# Altium project ECU V1.0 B.PrjPcb (part 16 of 17)
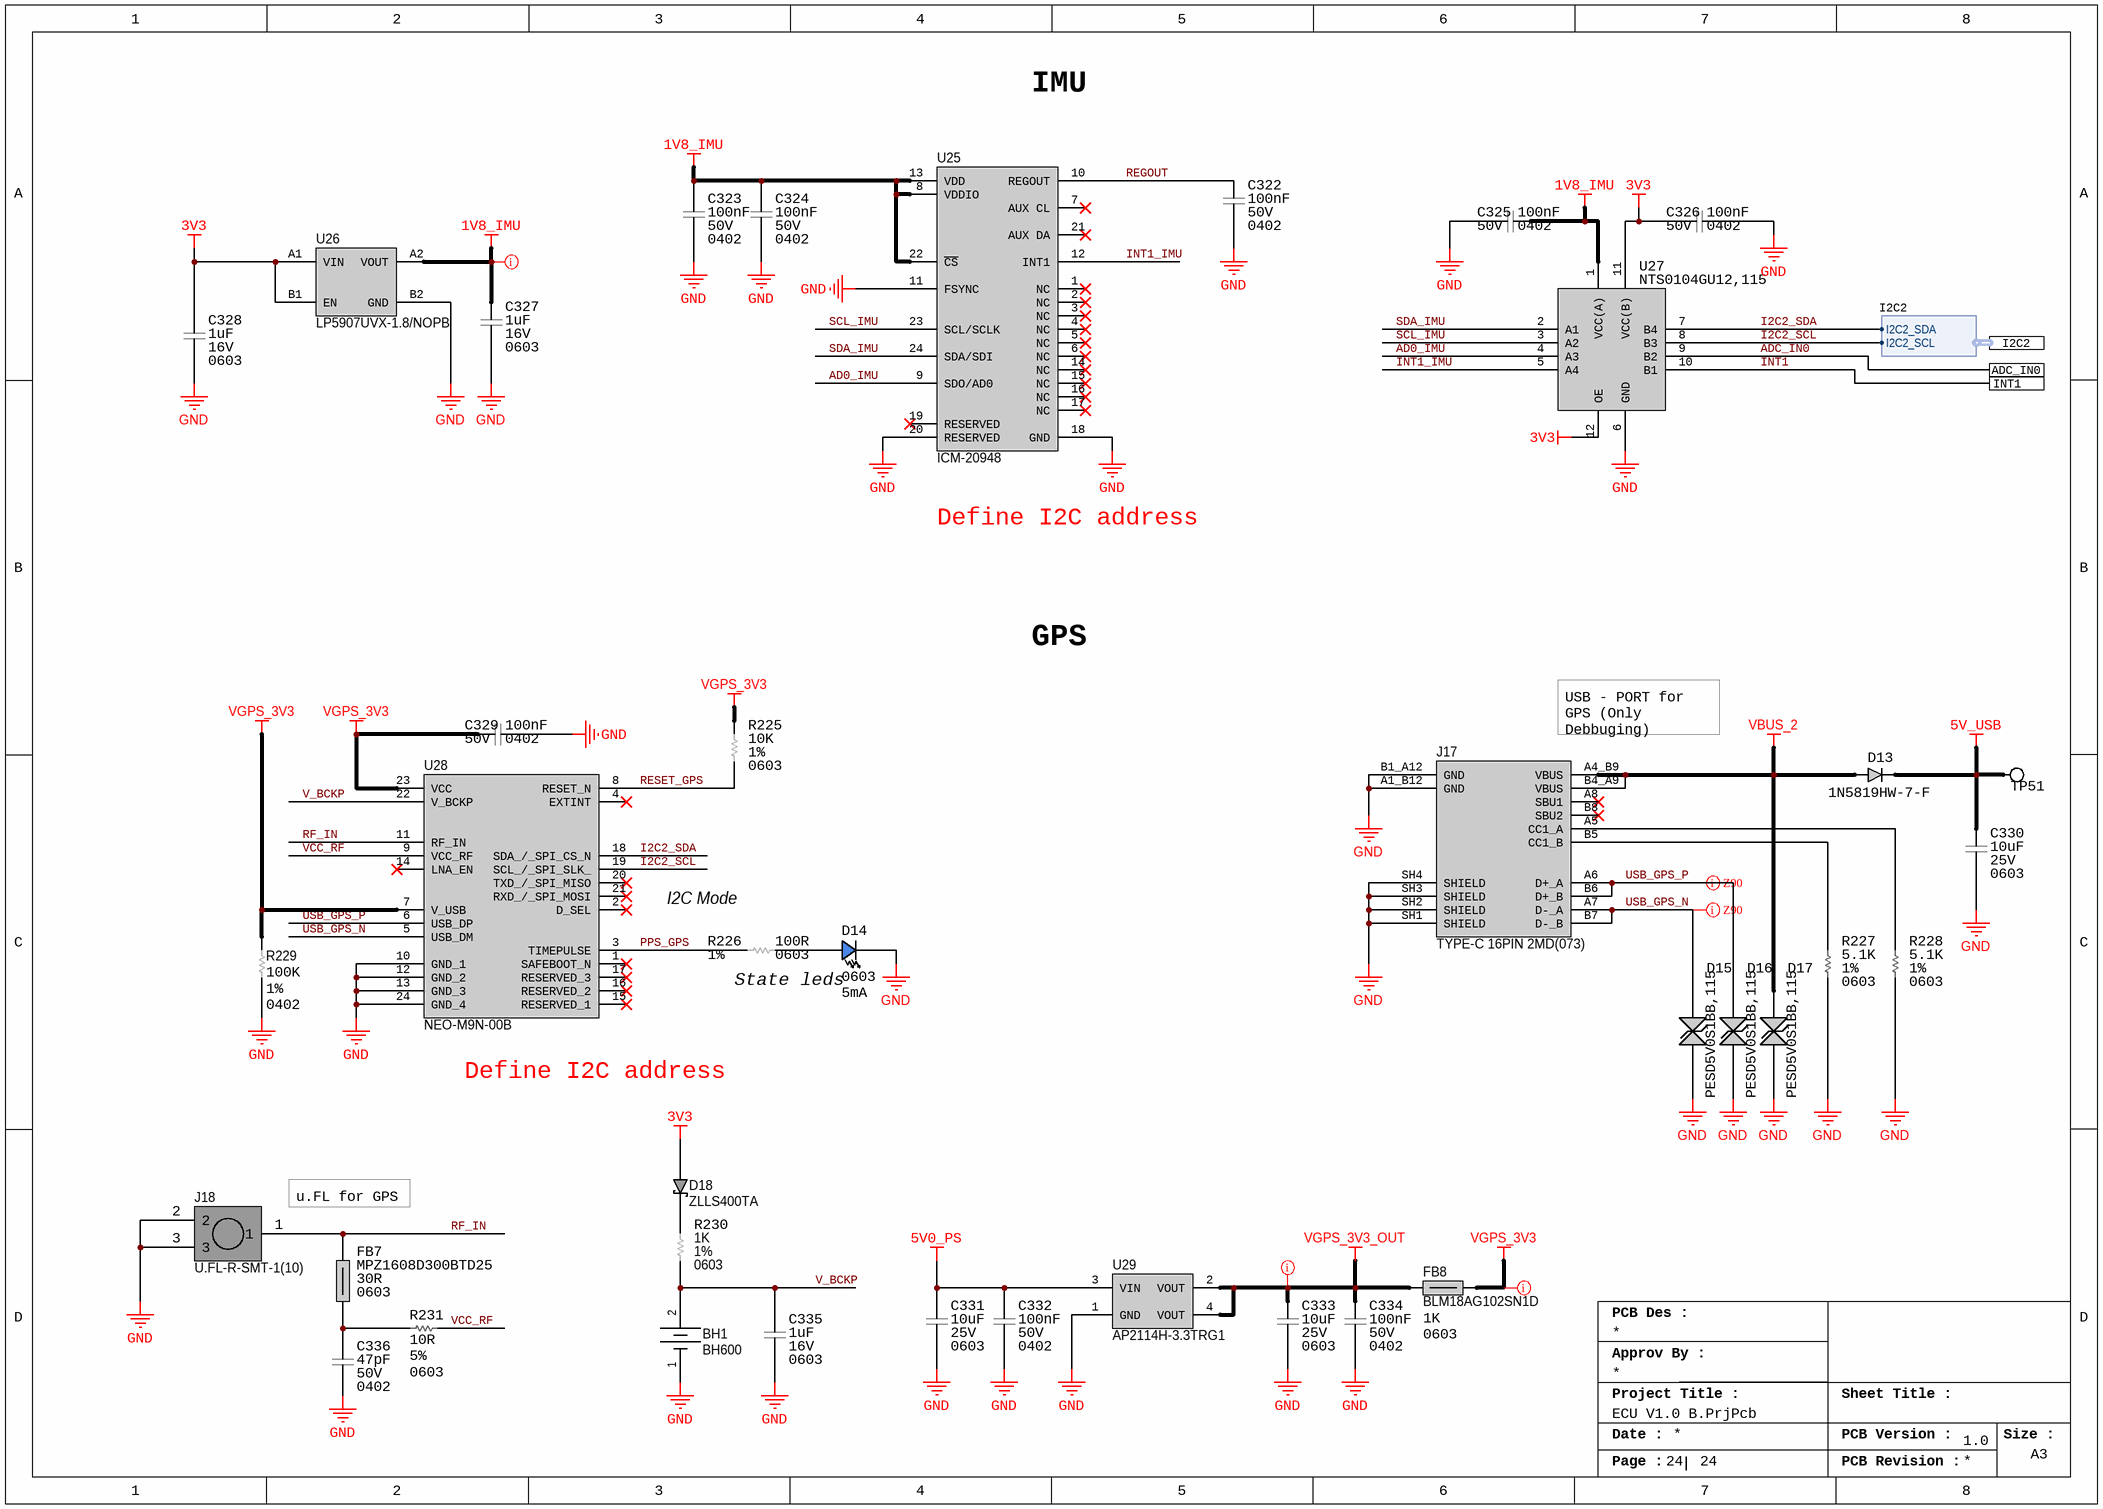
[diagram p22: 23_IMU_GPS.SchDoc]

## Sheet 23_IMU_GPS.SchDoc (continued)

### Library data of the parts
BH1 = MECH_BATTERY_HOLDER_BH600: Battery Holder 1 Cells Thermoplastic Tray; Manufacturer: Memory Protection Devices; Number of Cells: 1; Supplier 1: Digikey; Manufacturer Part Number: BH600; RoHS: Yes; Category: Batteries and Accessories; Stock 1: 122929; Pricing 1: 1=1.7, 10=1.408, 50=1.236, 100=1.1686, 300=1.06927, 500=1.02602, 1000=0.97012, 2500=0.90087, 5000=0.85178 (USD); Mount: Through Hole,PCB; Min Operating Temperature: -55°C; Max Operating Temperature: 180°C; Series: -; Termination: PC Pin; Diameter: 16mm; Height: 3.2mm; Lead Free: Lead Free; RoHS Compliant: Yes; ComponentLink1URL: https://datasheet.ciiva.com/3/bh600-datasheet-3856.pdf?src-supplier=Digikey; ComponentLink1Description: https://datasheet.ciiva.com/3/bh600-datasheet-3856.pdf?src-supplier=Digikey; Supplier Part Number 1: BH600-ND
C322-C326 C329 C332 C334 = CAP_100NF_50V_X7R_0402: Multilayer Ceramic Capacitor, 0.1 uF, 16 V, ± 10%, X7R, 0402 [1005 Metric]; Manufacturer: Murata; Dissipation Factor: 0.025%; Temperature Coefficient: 30ppm/°C; Supplier 1: DigiKey; Manufacturer Part Number: GRM155R71H104KE14D; RoHS: Yes; Category: Ceramic Capacitors; Stock 1: 13730790; Pricing 1: 1=0.1, 10=0.023, 50=0.0132, 100=0.0102, 500=0.00768, 1000=0.00603, 2500=0.00548, 5000=0.00504 (USD); Mount: Surface Mount; Number of Pins: 2NUMBER; Case Code (Metric): 1005; Material: Ceramic; Case Code (Imperial): 0402; Weight: 0.000212oz; Dielectric Material: Ceramic; Min Operating Temperature: -55°C; Max Operating Temperature: 125°C; Packaging: Tape and Reel; Package Quantity: 10000; Series: GRM; Tolerance: 10%; Dielectric: X7R; Termination: SMD/SMT; Voltage: 50V; Voltage Rating (DC): 50V; Construction: Flat; Length: 1mm; Width: 0.5mm; Height: 0.5mm; Depth: 0.5mm; Thickness: 0.022inch; Reach SVHC Compliant: No; RoHS Compliant: Yes; Lead Free: 5697LeadFree; ComponentLink1URL: http://www.farnell.com/datasheets/2079156.pdf?src-supplier=Farnell; ComponentLink1Description: http://www.farnell.com/datasheets/2079156.pdf?src-supplier=Farnell; ComponentLink2URL: http://www.mouser.com/ds/2/281/c02e-2905.pdf?src-supplier=Mouser; ComponentLink2Description: http://www.mouser.com/ds/2/281/c02e-2905.pdf?src-supplier=Mouser; ComponentLink3URL: http://www.farnell.com/datasheets/2079156.pdf?src-supplier=Newark; ComponentLink3Description: http://www.farnell.com/datasheets/2079156.pdf?src-supplier=Newark; ComponentLink4URL: https://datasheet.octopart.com/GRM155R71H104KE14D-Murata-datasheet-22122223.pdf?src-supplier=Future+Electronics; ComponentLink4Description: https://datasheet.octopart.com/GRM155R71H104KE14D-Murata-datasheet-22122223.pdf?src-supplier=Future+Electronics; ComponentLink5URL: https://search.murata.co.jp/Ceramy/image/img/A01X/G101/ENG/GRM155R71H104KE14-01.pdf?src-supplier=Digi-Key; ComponentLink5Description: https://search.murata.co.jp/Ceramy/image/img/A01X/G101/ENG/GRM155R71H104KE14-01.pdf?src-supplier=Digi-Key; ComponentLink6URL: http://psearch.en.murata.com/capacitor/product/GRM155R71H104KE14%23.pdf?src-supplier=Avnet; ComponentLink6Description: http://psearch.en.murata.com/capacitor/product/GRM155R71H104KE14%23.pdf?src-supplier=Avnet; ComponentLink7URL: https://datasheet.octopart.com/GRM155R71H104KE14D-Murata-datasheet-66077078.pdf?src-supplier=Element14; ComponentLink7Description: https://datasheet.octopart.com/GRM155R71H104KE14D-Murata-datasheet-66077078.pdf?src-supplier=Element14; Supplier Part Number 1: 490-10700-6-ND; Supplier 2: Digikey; Stock 2: 3706055; Pricing 2: 1=0.1, 10=0.037, 50=0.021, 100=0.0162, 500=0.01224, 1000=0.00961, 2500=0.00874, 5000=0.00804 (USD); Halogen Free: 5694HalogenFree; ComponentLink8URL: http://www.mouser.com/ds/2/447/UPY-GPHC_X5R_4V-to-50V_25-1131599.pdf?src-supplier=Mouser; ComponentLink8Description: http://www.mouser.com/ds/2/447/UPY-GPHC_X5R_4V-to-50V_25-1131599.pdf?src-supplier=Mouser; ComponentLink9URL: https://datasheet.octopart.com/CC0402KRX5R8BB104-Yageo-datasheet-137700082.pdf?src-supplier=Future+Electronics; ComponentLink9Description: https://datasheet.octopart.com/CC0402KRX5R8BB104-Yageo-datasheet-137700082.pdf?src-supplier=Future+Electronics; ComponentLink10URL: http://www.yageo.com/documents/recent/UPY-GPHC_X5R_4V-to-50V_25.pdf?src-supplier=Digikey; ComponentLink10Description: http://www.yageo.com/documents/recent/UPY-GPHC_X5R_4V-to-50V_25.pdf?src-supplier=Digikey; ComponentLink11URL: https://datasheet.octopart.com/CC0402KRX5R8BB104-Yageo-datasheet-140260304.pdf?src-supplier=Newark; ComponentLink11Description: https://datasheet.octopart.com/CC0402KRX5R8BB104-Yageo-datasheet-140260304.pdf?src-supplier=Newark; ComponentLink12URL: https://datasheet.octopart.com/CC0402KRX5R8BB104-Yageo-datasheet-170350636.pdf?src-supplier=Future+Electronics; ComponentLink12Description: https://datasheet.octopart.com/CC0402KRX5R8BB104-Yageo-datasheet-170350636.pdf?src-supplier=Future+Electronics; ComponentLink13URL: http://www.yageo.com/documents/recent/UPY-GPHC_X5R_4V-to-50V-16.pdf?src-supplier=Future+Electronics; ComponentLink13Description: http://www.yageo.com/documents/recent/UPY-GPHC_X5R_4V-to-50V-16.pdf?src-supplier=Future+Electronics; Supplier Part Number 2: 311-1697-1-ND
C327 C328 C335 = CAP_1UF_16V_X5R_0603: CAP CER 1UF 16V X5R 0603; Manufacturer: Samsung; Material: Ceramic; Tolerance: 10%; Manufacturer Part Number: CL10A105KO8NNNC; RoHS: Yes; Category: Ceramic Capacitors; Stock 1: 252255; Pricing 1: 1=0.10000, 10=0.03300, 50=0.01800, 100=0.01470, 500=0.01050, 1000=0.00825 (USD); Mount: Surface Mount; Case Code (Metric): 1608; Case Code (Imperial): 0603; Contact Plating: Tin; Min Operating Temperature: -55°C; Max Operating Temperature: 85°C; Package Quantity: 1; Packaging: Tape and Reel; Dielectric: X5R; Voltage Rating (DC): 16V; Series: CL; Voltage: 16V; Construction: Flat; Length: 1.6mm; Width: 0.031inch; Height: 0.8mm; Thickness: 0.035inch; Depth: 0.8mm; Radiation Hardening: No; Lead Free: Lead Free; RoHS Compliant: Yes; ComponentLink1URL: https://datasheet.ciiva.com/16199/cl10a105ko8nnnc-16199033.pdf?src-supplier=Future+Electronics; ComponentLink1Description: https://datasheet.ciiva.com/16199/cl10a105ko8nnnc-16199033.pdf?src-supplier=Future+Electronics; ComponentLink2URL: https://datasheet.ciiva.com/15195/getdatasheetpartid-359688-15195706.pdf?src-supplier=Verical; ComponentLink2Description: https://datasheet.ciiva.com/15195/getdatasheetpartid-359688-15195706.pdf?src-supplier=Verical; ComponentLink3URL: https://datasheet.ciiva.com/29198/458190-da-01-en-vs-kondensator-0603-29198480.pdf?src-supplier=Conrad; ComponentLink3Description: https://datasheet.ciiva.com/29198/458190-da-01-en-vs-kondensator-0603-29198480.pdf?src-supplier=Conrad; Supplier 1: Digi-Key; Supplier 2: Mouser; Supplier 3: Newark; Supplier Part Number 1: 1276-1034-1-ND; Supplier Part Number 2: 187-CL10A105KO8NNNC; Supplier Part Number 3: 82AC9279
C330 C331 C333 = CAP_10UF_25V_X5R_0603: Multilayer Ceramic Capacitor, 10 uF, 25 V, ± 20%, X5R, 0603 [1608 Metric]; Manufacturer: Murata; Material: 4241ConductorMaterial; Supplier 1: Digi-Key; Manufacturer Part Number: GRM188R61E106MA73D; RoHS: Yes; Category: Ceramic Capacitors; Stock 1: 2712970; Pricing 1: 1=0.26, 10=0.168, 50=0.1176, 100=0.0949, 500=0.07054, 1000=0.06173 (USD); Mount: Surface Mount; Number of Pins: 2; Case Code (Imperial): 0603; Weight: 0.000222oz; Min Operating Temperature: -55°C; Max Operating Temperature: 85°C; Tolerance: 20%; Packaging: Cut Tape; Package Quantity: 1; Dielectric: X5R; Voltage: 25V; Termination: SMD/SMT; Voltage Rating (DC): 25V; Series: GRM; Construction: Flat; Length: 1.6mm; Width: 0.031inch; Height: 0.8mm; Thickness: 0.031inch; Depth: 0.8mm; Reach SVHC Compliant: No; Lead Free: Lead Free; RoHS Compliant: Yes; ComponentLink1URL: https://datasheet.ciiva.com/22776/c02e-22776427.pdf?src-supplier=Farnell; ComponentLink1Description: https://datasheet.ciiva.com/22776/c02e-22776427.pdf?src-supplier=Farnell; ComponentLink2URL: https://datasheet.ciiva.com/22619/c02e-22619674.pdf?src-supplier=Element14; ComponentLink2Description: https://datasheet.ciiva.com/22619/c02e-22619674.pdf?src-supplier=Element14; ComponentLink3URL: https://datasheet.ciiva.com/22776/608985-22776426.pdf?src-supplier=Farnell; ComponentLink3Description: https://datasheet.ciiva.com/22776/608985-22776426.pdf?src-supplier=Farnell; ComponentLink4URL: https://datasheet.ciiva.com/14906/partnumbering-e-01-14906431.pdf?src-supplier=Digi-Key; ComponentLink4Description: https://datasheet.ciiva.com/14906/partnumbering-e-01-14906431.pdf?src-supplier=Digi-Key; ComponentLink5URL: https://datasheet.ciiva.com/14906/partnumbering-e-01-14906429.pdf?src-supplier=Digi-Key; ComponentLink5Description: https://datasheet.ciiva.com/14906/partnumbering-e-01-14906429.pdf?src-supplier=Digi-Key; Supplier Part Number 1: 490-7202-1-ND; Case Code (Metric): 1608
C336 = CAP_47pF_50V_NP0_0402: Cap Ceramic 47pF 50V C0G 5% Pad SMD 0402 125°C Low ESR Automotive T/R; Manufacturer: Murata; Supplier 1: Digikey; Manufacturer Part Number: GCQ1555C1H470JB01D; RoHS: Yes; Category: Ceramic Capacitors; Stock 1: 15503; Pricing 1: 1=0.17, 10=0.095, 100=0.0589, 1000=0.04009, 2500=0.03543, 5000=0.03366 (USD); Mount: Surface Mount; Case Code (Imperial): 0402; Case Code (Metric): 1005; Min Operating Temperature: -55°C; Max Operating Temperature: 125°C; Packaging: Cut Tape; Tolerance: 5%; Series: GCQ; Ratings: AEC-Q200; RoHS Compliant: Yes; ComponentLink1URL: http://search.murata.co.jp/Ceramy/image/img/A01X/G101/ENG/GCQ1555C1H470JB01-01.pdf?src-supplier=Digikey; ComponentLink1Description: http://search.murata.co.jp/Ceramy/image/img/A01X/G101/ENG/GCQ1555C1H470JB01-01.pdf?src-supplier=Digikey; ComponentLink2URL: https://search.murata.co.jp/Ceramy/image/img/A01X/G101/ENG/GCQ1555C1H470JB01-01.pdf?src-supplier=Digikey; ComponentLink2Description: https://search.murata.co.jp/Ceramy/image/img/A01X/G101/ENG/GCQ1555C1H470JB01-01.pdf?src-supplier=Digikey; Supplier Part Number 1: 490-17472-1-ND
D13 = DIO_RECT_40V_1A_1N5819HW-7-F: Rectifier Diode, Schottky, 1 Phase, 1 Element, 1A, 40V V(RRM), Silicon; Manufacturer: Diodes; Max Reverse Current: 50uA; Max Forward Surge Current (Ifsm): 25A; Forward Voltage: 450mV; Max Power Dissipation: 450mW; Polarity: Standard; Capacitance: 50pF; Supplier 1: Digikey; Manufacturer Part Number: 1N5819HW-7-F; RoHS: Yes; Category: Rectifier Diodes; Stock 1: 221439; Pricing 1: 1=0.41, 10=0.289, 100=0.146, 500=0.11908, 1000=0.08836 (USD); Case/Package: SOD-123-2; Number of Pins: 2; Weight: 0.000353oz; Min Operating Temperature: -65°C; Max Operating Temperature: 125°C; Forward Current: 1A; Max Repetitive Reverse Voltage (Vrrm): 40V; Packaging: Tape and Reel; Peak Non-Repetitive Surge Current: 25A; Package Quantity: 3000; Average Rectified Current: 1A; Termination: SMD/SMT; Voltage Rating (DC): 40V; Current Rating: 1A; Output Current: 1A; Max Reverse Voltage (DC): 40V; Series: -; Reverse Voltage: 40V; Length: 2.85mm; Width: 1.7mm; Height: 1.25mm; Radiation Hardening: No; RoHS Compliant: Yes; Reach SVHC Compliant: No; Lead Free: Lead Free; ComponentLink1URL: https://datasheet.ciiva.com/16303/ds30217-16303296.pdf?src-supplier=Future+Electronics; ComponentLink1Description: https://datasheet.ciiva.com/16303/ds30217-16303296.pdf?src-supplier=Future+Electronics; ComponentLink2URL: https://datasheet.ciiva.com/27092/1538419-27092484.pdf?src-supplier=Jameco; ComponentLink2Description: https://datasheet.ciiva.com/27092/1538419-27092484.pdf?src-supplier=Jameco; ComponentLink3URL: https://datasheet.ciiva.com/912/ds30217-912801.pdf?src-supplier=Digikey; ComponentLink3Description: https://datasheet.ciiva.com/912/ds30217-912801.pdf?src-supplier=Digikey; ComponentLink4URL: https://datasheet.ciiva.com/912/ds30217-912802.pdf?src-supplier=Digikey; ComponentLink4Description: https://datasheet.ciiva.com/912/ds30217-912802.pdf?src-supplier=Digikey; ComponentLink5URL: https://datasheet.ciiva.com/912/ds30217-912803.pdf?src-supplier=Digikey; ComponentLink5Description: https://datasheet.ciiva.com/912/ds30217-912803.pdf?src-supplier=Digikey; ComponentLink6URL: https://datasheet.ciiva.com/8303/ds30217-8303132.pdf?src-supplier=Avnet; ComponentLink6Description: https://datasheet.ciiva.com/8303/ds30217-8303132.pdf?src-supplier=Avnet; ComponentLink7URL: https://datasheet.ciiva.com/1177/ds30217-1177089.pdf?src-supplier=Element14; ComponentLink7Description: https://datasheet.ciiva.com/1177/ds30217-1177089.pdf?src-supplier=Element14; Supplier Part Number 1: 1N5819HW-FDIDKR-ND
D14 = LED_DIO_BLUE_5mA_0603: LED Uni-Color Blue 468nm 2-Pin Chip LED T/R; Manufacturer: Vishay Lite-On; Lens Color: Colorless; Luminous Intensity: 15mcd; Viewing Angle: 130°; Lens Style: Diffused,Colorless,Rectangular,Clear; Dominant Wavelength: 475nm; Lens Transparency: Clear; Number of Elements: 1; Power Dissipation: 76mW; Reverse Voltage: 5V; Forward Current: 20mA; Forward Voltage: 2.8V; Manufacturer Part Number: LTST-C193TBKT-5A; RoHS: Yes; Category: LEDs; Stock 1: 924158; Pricing 1: 1=0.30000, 10=0.23400, 100=0.10510, 500=0.09492, 1000=0.07797, 2000=0.06780 (USD); Mount: Surface Mount; Case/Package: 0603; Number of Pins: 2; Color: Blue; Case Code (Metric): 1608; Min Operating Temperature: -20°C; Max Operating Temperature: 80°C; Packaging: Tape and Reel; Package Quantity: 1; Number of LEDs: 1; Length: 1.6mm; Width: 0.8mm; Height: 0.35mm; Depth: 0.8mm; Radiation Hardening: No; RoHS Compliant: Yes; Lead Free: Lead Free; ComponentLink1URL: https://datasheet.ciiva.com/2111/ltst-c193tbkt-5a-2111219.pdf?src-supplier=Digi-Key; ComponentLink1Description: https://datasheet.ciiva.com/2111/ltst-c193tbkt-5a-2111219.pdf?src-supplier=Digi-Key; ComponentLink2URL: https://datasheet.ciiva.com/4688/lite-on-ltst-c193tbkt-5a-187386-4688832.pdf?src-supplier=Mouser; ComponentLink2Description: https://datasheet.ciiva.com/4688/lite-on-ltst-c193tbkt-5a-187386-4688832.pdf?src-supplier=Mouser; ComponentLink3URL: https://datasheet.ciiva.com/16210/ltst-c193tbkt-5a-16210824.pdf?src-supplier=Future+Electronics; ComponentLink3Description: https://datasheet.ciiva.com/16210/ltst-c193tbkt-5a-16210824.pdf?src-supplier=Future+Electronics; ComponentLink4URL: https://datasheet.ciiva.com/15201/getdatasheetpartid-293056-15201395.pdf?src-supplier=Verical; ComponentLink4Description: https://datasheet.ciiva.com/15201/getdatasheetpartid-293056-15201395.pdf?src-supplier=Verical; ComponentLink5URL: https://datasheet.ciiva.com/11773/0900766b80dc0554-11773880.pdf?src-supplier=Rs; ComponentLink5Description: https://datasheet.ciiva.com/11773/0900766b80dc0554-11773880.pdf?src-supplier=Rs; ComponentLink6URL: https://datasheet.ciiva.com/2111/p-100-ltst-c193tbkt-5a-2111220.pdf?src-supplier=Digi-Key; ComponentLink6Description: https://datasheet.ciiva.com/2111/p-100-ltst-c193tbkt-5a-2111220.pdf?src-supplier=Digi-Key; ComponentLink7URL: https://datasheet.ciiva.com/2111/p-100-ltst-c193tbkt-5a-2111221.pdf?src-supplier=Digi-Key; ComponentLink7Description: https://datasheet.ciiva.com/2111/p-100-ltst-c193tbkt-5a-2111221.pdf?src-supplier=Digi-Key; Supplier 1: Digi-Key; Supplier 2: Arrow Electronics; Supplier 3: Future Electronics; Supplier Part Number 1: 160-1827-1-ND; Supplier Part Number 2: LTST-C193TBKT-5A; Supplier Part Number 3: 1101072; Illumination Color: Blue
D15-D17 = DIO_TVS_BID_5V_PESD5V0S1BB,115: ESD Suppressor Diode TVS Bi-Dir 5V Automotive 2-Pin SOD-523 T/R / TVS DIODE 5VWM 14VC SOD523; Manufacturer: Nexperia; Breakdown Voltage: 5.5V; Supplier 1: Digikey; Manufacturer Part Number: PESD5V0S1BB,115; RoHS: Yes; Category: ESD and Circuit Protection ICs; Stock 1: 221713; Pricing 1: 1=0.35, 10=0.243, 100=0.1226, 500=0.10004, 1000=0.07422, 3000=0.06245, 6000=0.0597, 9000=0.05163, 30000=0.05067, 75000=0.04195, 150000=0.04131 (USD); Number of Pins: 2; Packaging: Tape and Reel; Operating Supply Voltage: 5V; RoHS Compliant: Yes; ComponentLink1URL: http://www.farnell.com/datasheets/461331.pdf?src-supplier=Farnell; ComponentLink1Description: http://www.farnell.com/datasheets/461331.pdf?src-supplier=Farnell; ComponentLink2URL: https://www.mouser.com/ds/2/302/PESD5V0S1BA_BB_BL-1150699.pdf?src-supplier=Mouser; ComponentLink2Description: https://www.mouser.com/ds/2/302/PESD5V0S1BA_BB_BL-1150699.pdf?src-supplier=Mouser; ComponentLink3URL: https://assets.nexperia.com/documents/data-sheet/PESD5V0S1BA_BB_BL.pdf?src-supplier=Digikey; ComponentLink3Description: https://assets.nexperia.com/documents/data-sheet/PESD5V0S1BA_BB_BL.pdf?src-supplier=Digikey; ComponentLink4URL: http://www.farnell.com/datasheets/461331.pdf?src-supplier=Newark; ComponentLink4Description: http://www.farnell.com/datasheets/461331.pdf?src-supplier=Newark; Supplier Part Number 1: 1727-3838-1-ND
D18 = DIO_SCTKY_40V_520mA_ZLLS400TA: DIODE SCHOTTKY 40V 520MA SOD323; Manufacturer: Diodes Zetex; Peak Non-Repetitive Surge Current: 12A; Max Reverse Current: 10uA; Forward Voltage: 800mV; Reverse Recovery Time: 3ns; Max Forward Surge Current (Ifsm): 2.5A; Power Dissipation: 330mW; Polarity: Standard; Capacitance: 15pF; Supplier 1: Digi-Key; Manufacturer Part Number: ZLLS400TA; RoHS: Yes; Category: Rectifier Diodes; Stock 1: 46017; Pricing 1: 1=0.42, 10=0.359, 100=0.2495, 500=0.19478, 1000=0.15832 (USD); Mount: Surface Mount; Number of Pins: 2; Weight: 0.000173oz; Min Operating Temperature: -55°C; Max Operating Temperature: 150°C; Forward Current: 520mA; Max Repetitive Reverse Voltage (Vrrm): 40V; Package Quantity: 3000; Packaging: Tape and Reel; Average Rectified Current: 520mA; Termination: SMD/SMT; Voltage Rating (DC): 40V; Current Rating: 520mA; Output Current: 520mA; Max Reverse Voltage (DC): 40V; Series: -; Length: 1.8mm; Width: 1.4mm; Height: 0.8mm; Radiation Hardening: No; Lead Free: Lead Free; RoHS Compliant: Yes; ComponentLink1URL: https://datasheet.ciiva.com/914/zlls400-914210.pdf?src-supplier=Digi-Key; ComponentLink1Description: https://datasheet.ciiva.com/914/zlls400-914210.pdf?src-supplier=Digi-Key; ComponentLink2URL: https://datasheet.ciiva.com/914/zlls400-914210.pdf?src-supplier=Avnet; ComponentLink2Description: https://datasheet.ciiva.com/914/zlls400-914210.pdf?src-supplier=Avnet; ComponentLink3URL: https://datasheet.ciiva.com/4715/zlls400-4715517.pdf?src-supplier=Mouser; ComponentLink3Description: https://datasheet.ciiva.com/4715/zlls400-4715517.pdf?src-supplier=Mouser; ComponentLink4URL: https://datasheet.ciiva.com/16379/zlls400-16379288.pdf?src-supplier=Future+Electronics; ComponentLink4Description: https://datasheet.ciiva.com/16379/zlls400-16379288.pdf?src-supplier=Future+Electronics; ComponentLink5URL: https://datasheet.ciiva.com/914/zlls400-914211.pdf?src-supplier=Digi-Key; ComponentLink5Description: https://datasheet.ciiva.com/914/zlls400-914211.pdf?src-supplier=Digi-Key; ComponentLink6URL: https://datasheet.ciiva.com/914/zlls400-914212.pdf?src-supplier=Digi-Key; ComponentLink6Description: https://datasheet.ciiva.com/914/zlls400-914212.pdf?src-supplier=Digi-Key; Supplier Part Number 1: ZLLS400TACT-ND
FB7 = IND_FERRITE_BEADS_30R_1.8A: Ferrite Beads Multi-Layer 30Ohm 10Ohm 100MHz 1.8A 0.06Ohm DCR 0603 Automotive T/R; Manufacturer: TDK; Core Material: 228ConductorMaterial; Number of Lines: 1; Series Resistance: 60mR; Supplier 1: Digikey; Manufacturer Part Number: MPZ1608D300BTD25; RoHS: Yes; Category: Ferrite Beads and Chips; Stock 1: 53701; Pricing 1: 1=0.1, 10=0.064, 25=0.056, 50=0.0502, 100=0.045, 250=0.03876, 500=0.03448, 1000=0.03052 (USD); Mount: Surface Mount; Case Code (Metric): 1608; Case Code (Imperial): 0603; Weight: 7.1E-05oz; Min Operating Temperature: -55°C; Max Operating Temperature: 125°C; Package Quantity: 4000; Packaging: Tape and Reel; Termination: SMD/SMT; Max DC Current: 1.8A; Test Frequency: 100MHz; Series: MPZ; RMS Current (Irms): 1.8A; Length: 1.6mm; Width: 0.8mm; Height: 0.8mm; Ratings: AEC-Q200; RoHS Compliant: Yes; ComponentLink1URL: https://media.digikey.com/pdf/Data%20Sheets/TDK%20PDFs/MPZ_Series_Br.pdf?src-supplier=Digikey; ComponentLink1Description: https://media.digikey.com/pdf/Data%20Sheets/TDK%20PDFs/MPZ_Series_Br.pdf?src-supplier=Digikey; ComponentLink2URL: http://www.mouser.com/ds/2/400/eads_commercial_power_mpz1608_en-923650.pdf?src-supplier=Mouser; ComponentLink2Description: http://www.mouser.com/ds/2/400/eads_commercial_power_mpz1608_en-923650.pdf?src-supplier=Mouser; ComponentLink3URL: https://product.tdk.com/info/en/catalog/datasheets/beads_automotive_power_mpz1608_en.pdf?ref_disty=digikey&src-supplier=Digikey; ComponentLink3Description: https://product.tdk.com/info/en/catalog/datasheets/beads_automotive_power_mpz1608_en.pdf?ref_disty=digikey&src-supplier=Digikey; Supplier Part Number 1: 445-MPZ1608D300BTD25CT-ND; Max Current Rating: 1.8A
FB8 = IND_FERRITA_1K_450mA_BLM18AG102SN1D: Ferrite Beads Multi-Layer 1KOhm 25% 100MHz 450mA 500mOhm DCR 0603 T/R; Manufacturer: Murata; Material: Steel,Ferrite; Max DC Current: 400mA; DC Resistance (DCR): 500mR; Number of Lines: 1; Shielding: Unshielded; DC Resistance-Max: 700mR; Supplier 1: Digikey; Manufacturer Part Number: BLM18AG102SN1D; RoHS: Yes; Category: Ferrite Beads and Chips; Stock 1: 632067; Pricing 1: 1=0.1, 10=0.074, 25=0.0676, 50=0.0608, 100=0.0445, 250=0.0324, 500=0.02968, 1000=0.02564 (USD); Number of Pins: 2; Core Material: Ferrite; Case Code (Metric): 1608; Case Code (Imperial): 0603; Min Operating Temperature: -55°C; Max Operating Temperature: 125°C; Tolerance: 25%; Package Quantity: 1; Resistance: 500mR; Packaging: Tape and Reel; Current Rating: 400mA; Max Current Rating: 400mA; Termination: SMD/SMT; Test Frequency: 100MHz; DC Current: 400mA; Frequency: 100MHz; Number of Circuits: 1; Series: BLM18A; RMS Current (Irms): 450mA; Series Resistance: 500mR; Length: 1.6mm; Width: 0.8mm; Height: 0.8mm; Depth: 0.8mm; Radiation Hardening: No; Reach SVHC Compliant: No; Military Standard: Not; Lead Free: Lead Free; RoHS Compliant: Yes; ComponentLink1URL: https://datasheet.ciiva.com/1012/l0110s0100blm18a-1012016.pdf?src-supplier=Digikey; ComponentLink1Description: https://datasheet.ciiva.com/1012/l0110s0100blm18a-1012016.pdf?src-supplier=Digikey; ComponentLink2URL: https://datasheet.ciiva.com/5709/1756147-5709056.pdf?src-supplier=Farnell; ComponentLink2Description: https://datasheet.ciiva.com/5709/1756147-5709056.pdf?src-supplier=Farnell; ComponentLink3URL: https://datasheet.ciiva.com/11795/0900766b80032ea2-11795437.pdf?src-supplier=Rs; ComponentLink3Description: https://datasheet.ciiva.com/11795/0900766b80032ea2-11795437.pdf?src-supplier=Rs; ComponentLink4URL: https://datasheet.ciiva.com/29347/442253-da-01-en-chip-drossel-0603-1000r-400ma-1-6x0-8mm-29347887.pdf?src-supplier=Conrad; ComponentLink4Description: https://datasheet.ciiva.com/29347/442253-da-01-en-chip-drossel-0603-1000r-400ma-1-6x0-8mm-29347887.pdf?src-supplier=Conrad; ComponentLink5URL: https://datasheet.ciiva.com/41449/001172220-da-01-en-drossel-0603-1000r-1-6x0-8mm-4000st-41449508.pdf?src-supplier=Conrad; ComponentLink5Description: https://datasheet.ciiva.com/41449/001172220-da-01-en-drossel-0603-1000r-1-6x0-8mm-4000st-41449508.pdf?src-supplier=Conrad; ComponentLink6URL: https://datasheet.ciiva.com/1012/l0110s0100blm18a-1012014.pdf?src-supplier=Digikey; ComponentLink6Description: https://datasheet.ciiva.com/1012/l0110s0100blm18a-1012014.pdf?src-supplier=Digikey; ComponentLink7URL: https://datasheet.ciiva.com/1012/l0110s0100blm18a-1012015.pdf?src-supplier=Digikey; ComponentLink7Description: https://datasheet.ciiva.com/1012/l0110s0100blm18a-1012015.pdf?src-supplier=Digikey; ComponentLink8URL: https://datasheet.ciiva.com/16199/l0110s0100blm18a-16199225.pdf?src-supplier=Future+Electronics; ComponentLink8Description: https://datasheet.ciiva.com/16199/l0110s0100blm18a-16199225.pdf?src-supplier=Future+Electronics; ComponentLink9URL: https://datasheet.ciiva.com/8510/l0110s0100blm18a-8510154.pdf?src-supplier=Avnet; ComponentLink9Description: https://datasheet.ciiva.com/8510/l0110s0100blm18a-8510154.pdf?src-supplier=Avnet; ComponentLink10URL: https://datasheet.ciiva.com/1466/1756147-1466919.pdf?src-supplier=Element14; ComponentLink10Description: https://datasheet.ciiva.com/1466/1756147-1466919.pdf?src-supplier=Element14; ComponentLink11URL: https://datasheet.ciiva.com/1466/1756147-1466920.pdf?src-supplier=Element14; ComponentLink11Description: https://datasheet.ciiva.com/1466/1756147-1466920.pdf?src-supplier=Element14; Supplier Part Number 1: 490-1015-1-ND
J17 = CONN_USB_TYPEC_2.0_16P_TYPE-C 16PIN 2MD(073): 5A 1 Surface Mount 16P Female -25℃~+85℃ Type-C SMD USB Connectors ROHS; Manufacturer: SHOU HAN; Supplier 1: LCSC; Manufacturer Part Number: TYPE-C 16PIN 2MD(073); RoHS: No; Category: Connectors; Pricing 1: 0.0523 (USD); Supplier Part Number 1: 664-12402012E212ACT-ND
J18 = CONN_UFL_RF_5OR_U.FL-R-SMT-1(10): RF Connector, 1 Contact(s), Male, Board Mount, Surface Mount Terminal, Receptacle; Manufacturer: Hirose; Body Material: Bronze; Body Plating: Silver; Dielectric Material: Polymer; Center Contact Plating: Gold; Impedance: 50R; Connector Type: Receptacle,Male Pin; Max Frequency: 6GHz; Number of Ports: 1; Mating Cycles: 30; Insulation Resistance: 500MR; Supplier 1: Digikey; Manufacturer Part Number: U.FL-R-SMT-1(10); RoHS: Yes; Category: RF / Coaxial Connectors; Stock 1: 174716; Pricing 1: 1=1.26, 10=1.064, 25=1.0208, 50=0.9988, 100=0.9555, 250=0.8686, 500=0.78174, 1000=0.69488 (USD); Mount: Surface Mount; Contact Material: Brass; Housing Color: Beige; Weight: 0.001764oz; Min Operating Temperature: -40°C; Max Operating Temperature: 90°C; Packaging: Tape and Reel; Package Quantity: 2500; Fastening Type: SNAP-ON; Termination: Solder; Series: U.FL; Orientation: Straight; RoHS Compliant: Yes; Lead Free: 5697LeadFree; ComponentLink1URL: https://datasheet.ciiva.com/11762/0900766b8105243f-11762474.pdf?src-supplier=Rs; ComponentLink1Description: https://datasheet.ciiva.com/11762/0900766b8105243f-11762474.pdf?src-supplier=Rs; ComponentLink2URL: https://datasheet.ciiva.com/7651/91524-7651914.pdf?src-supplier=Element14; ComponentLink2Description: https://datasheet.ciiva.com/7651/91524-7651914.pdf?src-supplier=Element14; ComponentLink3URL: https://datasheet.ciiva.com/7651/91524-7651915.pdf?src-supplier=Element14; ComponentLink3Description: https://datasheet.ciiva.com/7651/91524-7651915.pdf?src-supplier=Element14; Supplier Part Number 1: H11891DKR-ND
R225 = RES_10K_1%_100mW_0603: Chip Resistor Automotive Grade Thick Film 0603 10kOhm 1% Paper T/R; Manufacturer: Yageo; Voltage Rating: 50V; Power Rating: 100mW; Temperature Coefficient: 100ppm/°C; Manufacturer Part Number: AC0603FR-1010KL; RoHS: Yes; Category: Chip SMD Resistors; Stock 1: 172891; Pricing 1: 1=0.10000, 10=0.02500, 100=0.01030, 1000=0.00463, 2500=0.00402, 5000=0.00332 (USD); Case Code (Imperial): 0603; Case Code (Metric): 1608; Weight: 7.1E-05oz; Min Operating Temperature: -55°C; Max Operating Temperature: 155°C; Packaging: Tape and Reel; Termination: SMD/SMT; Series: AC; Length: 1.6mm; Width: 0.8mm; Height: 0.45mm; RoHS Compliant: Yes; ComponentLink1URL: http://www.mouser.com/ds/2/447/yageodocoutput-1111992.pdf?src-supplier=Mouser; ComponentLink1Description: http://www.mouser.com/ds/2/447/yageodocoutput-1111992.pdf?src-supplier=Mouser; Supplier 1: Digi-Key; Supplier 2: Newark; Supplier 3: Avnet; Supplier Part Number 1: 13-AC0603FR-1010KLCT-ND; Supplier Part Number 2: 49AK0662; Supplier Part Number 3: 49AK0662
R226 = RES_100R_1%_100MW_0603: Res Thick Film 0603 100 Ohm 1% 1/10W ±100ppm/°C Molded SMD Punched Carrier T/R; Manufacturer: Panasonic; Power Rating: 100mW; Voltage Rating: 75V; Supplier 1: Mouser; Manufacturer Part Number: ERJ3EKF1000V; RoHS: Yes; Category: Chip SMD Resistors; Stock 1: 2420097; Pricing 1: 1=0.1, 10=0.024, 50=0.024, 100=0.011, 1000=0.008, 10000=0.005 (USD); Mount: Surface Mount; Case/Package: 0603; Contact Plating: Tin; Case Code (Metric): 1608; Weight: 7.1E-05oz; Size Code: 0603; Min Operating Temperature: -55°C; Max Operating Temperature: 155°C; Packaging: Tape and Reel; Package Quantity: 5000; Resistor Type: Thick Film; Termination: SMD/SMT; Temperature Coefficient: 100ppm/°C; Series: ERJ; Number of Terminations: 2; Max Power Dissipation: 100mW; Voltage Rating (DC): 75V; Features: Automotive AEC-Q200; Resistance Tolerance: 1%; Construction: Rectangular; Length: 1.6mm; Width: 0.8mm; Height: 0.45mm; Depth: 0.8mm; Radiation Hardening: No; Reach SVHC Compliant: No; Lead Free: Lead Free; RoHS Compliant: Yes; Military Standard: Not; ComponentLink1URL: https://datasheet.ciiva.com/34303/1987450-34303565.pdf?src-supplier=Jameco; ComponentLink1Description: https://datasheet.ciiva.com/34303/1987450-34303565.pdf?src-supplier=Jameco; ComponentLink2URL: https://datasheet.ciiva.com/24159/aoa0000ce2-24159753.pdf?src-supplier=Mouser; ComponentLink2Description: https://datasheet.ciiva.com/24159/aoa0000ce2-24159753.pdf?src-supplier=Mouser; ComponentLink3URL: https://datasheet.ciiva.com/30088/aoa0000ce2-30088649.pdf?src-supplier=Onlinecomponents.com; ComponentLink3Description: https://datasheet.ciiva.com/30088/aoa0000ce2-30088649.pdf?src-supplier=Onlinecomponents.com; ComponentLink4URL: https://datasheet.ciiva.com/16762/70260748-16762666.pdf?src-supplier=Allied+Electronics; ComponentLink4Description: https://datasheet.ciiva.com/16762/70260748-16762666.pdf?src-supplier=Allied+Electronics; ComponentLink5URL: https://datasheet.ciiva.com/16765/70260748-16765766.pdf?src-supplier=Allied+Electronics; ComponentLink5Description: https://datasheet.ciiva.com/16765/70260748-16765766.pdf?src-supplier=Allied+Electronics; ComponentLink6URL: https://datasheet.ciiva.com/9186/aoa0000ce2-9186725.pdf?src-supplier=Avnet; ComponentLink6Description: https://datasheet.ciiva.com/9186/aoa0000ce2-9186725.pdf?src-supplier=Avnet; ComponentLink7URL: https://datasheet.ciiva.com/48530/aoa0000ce2-48530986.pdf?src-supplier=Avnet; ComponentLink7Description: https://datasheet.ciiva.com/48530/aoa0000ce2-48530986.pdf?src-supplier=Avnet; ComponentLink8URL: https://datasheet.ciiva.com/22667/1678782-22667887.pdf?src-supplier=Element14; ComponentLink8Description: https://datasheet.ciiva.com/22667/1678782-22667887.pdf?src-supplier=Element14; ComponentLink9URL: https://datasheet.ciiva.com/46372/1678782-46372726.pdf?src-supplier=Element14; ComponentLink9Description: https://datasheet.ciiva.com/46372/1678782-46372726.pdf?src-supplier=Element14; ComponentLink10URL: https://datasheet.ciiva.com/46372/1678782-46372727.pdf?src-supplier=Element14; ComponentLink10Description: https://datasheet.ciiva.com/46372/1678782-46372727.pdf?src-supplier=Element14; ComponentLink11URL: https://datasheet.ciiva.com/7830/aoa0000ce2-7830728.pdf?src-supplier=Element14; ComponentLink11Description: https://datasheet.ciiva.com/7830/aoa0000ce2-7830728.pdf?src-supplier=Element14; Supplier Part Number 1: 667-ERJ-3EKF1000V
R227 R228 = RES_5.1K_1%_100mW_0603: SMD Chip Resistor, 5.1 kOhm, ± 1%, 100 mW, 0603 [1608 Metric], Thick Film, General Purpose; Manufacturer: Yageo; Power Rating: 100mW; Temperature Coefficient: 100ppm/°C; Voltage Rating (DC): 50V; Supplier 1: Digi-Key; Manufacturer Part Number: RC0603FR-075K1L; RoHS: Yes; Category: Chip SMD Resistors; Stock 1: 3197702; Pricing 1: 1=0.1, 10=0.018, 50=0.0106, 100=0.0088, 500=0.00592, 1000=0.00505 (USD); Number of Pins: 2; Case Code (Imperial): 0603; Case Code (Metric): 1608; Size Code: 0603; Min Operating Temperature: -55°C; Max Operating Temperature: 155°C; Series: RC; Packaging: Tape and Reel; Package Quantity: 1; Termination: SMD/SMT; Resistor Type: Thick Film; Number of Terminations: 2; Max Power Dissipation: 100mW; Features: Moisture Resistant; Resistance Tolerance: 1%; Construction: Rectangular; Length: 0.063inch; Width: 0.031inch; Height: 0.022inch; Depth: 0.8mm; RoHS Compliant: Yes; Reach SVHC Compliant: No; Military Standard: Not; Lead Free: Lead Free; ComponentLink1URL: https://datasheet.ciiva.com/15189/getdatasheetpartid-326732-15189786.pdf?src-supplier=Verical; ComponentLink1Description: https://datasheet.ciiva.com/15189/getdatasheetpartid-326732-15189786.pdf?src-supplier=Verical; ComponentLink2URL: https://datasheet.ciiva.com/46395/443971-46395016.pdf?src-supplier=Element14; ComponentLink2Description: https://datasheet.ciiva.com/46395/443971-46395016.pdf?src-supplier=Element14; ComponentLink3URL: https://datasheet.ciiva.com/2454/pyu-r-int-thick-7-2454045.pdf?src-supplier=Digi-Key; ComponentLink3Description: https://datasheet.ciiva.com/2454/pyu-r-int-thick-7-2454045.pdf?src-supplier=Digi-Key; ComponentLink4URL: https://datasheet.ciiva.com/2454/pyu-r-int-thick-7-2454046.pdf?src-supplier=Digi-Key; ComponentLink4Description: https://datasheet.ciiva.com/2454/pyu-r-int-thick-7-2454046.pdf?src-supplier=Digi-Key; ComponentLink5URL: https://datasheet.ciiva.com/2454/pyu-r-int-thick-7-2454047.pdf?src-supplier=Digi-Key; ComponentLink5Description: https://datasheet.ciiva.com/2454/pyu-r-int-thick-7-2454047.pdf?src-supplier=Digi-Key; Supplier Part Number 1: 311-5.10KHRCT-ND; Voltage Rating: 50V
R229 = RES_100K_1%_100mW_0402: SMD Chip Resistor, 100 kOhm, ± 1%, 63 mW, 0402 [1005 Metric], Thick Film, General Purpose; Manufacturer: Yageo; Temperature Coefficient: 100ppm/°C; Power Rating: 63mW; Voltage Rating: 50V; Supplier 1: Digi-Key; Manufacturer Part Number: RC0402FR-07100KL; RoHS: Yes; Category: Chip SMD Resistors; Stock 1: 27579413; Pricing 1: 1=0.1, 10=0.014, 50=0.0084, 100=0.007, 500=0.00464, 1000=0.00396, 5000=0.00282 (USD); Case Code (Metric): 1005; Case Code (Imperial): 0402; Min Operating Temperature: -55°C; Max Operating Temperature: 155°C; Resistor Type: Thick Film; Packaging: Tape and Reel; Package Quantity: 1; Number of Terminations: 2; Termination: SMD/SMT; Max Power Dissipation: 63mW; Features: Moisture Resistant; Series: RC; Resistance Tolerance: 1%; Construction: Rectangular; Technology: THICK FILM; Voltage Rating (AC): 50V; Length: 0.039inch; Width: 0.02inch; Height: 0.016inch; Depth: 0.5mm; Reach SVHC Compliant: No; RoHS Compliant: Yes; Lead Free: 5697LeadFree; Military Standard: Not; ComponentLink1URL: https://datasheet.ciiva.com/11819/0900766b80c66297-11819452.pdf?src-supplier=Rs; ComponentLink1Description: https://datasheet.ciiva.com/11819/0900766b80c66297-11819452.pdf?src-supplier=Rs; ComponentLink2URL: https://datasheet.ciiva.com/22747/1018594-22747509.pdf?src-supplier=Element14; ComponentLink2Description: https://datasheet.ciiva.com/22747/1018594-22747509.pdf?src-supplier=Element14; ComponentLink3URL: https://datasheet.ciiva.com/2453/pyu-r-int-thick-7-2453362.pdf?src-supplier=Digi-Key; ComponentLink3Description: https://datasheet.ciiva.com/2453/pyu-r-int-thick-7-2453362.pdf?src-supplier=Digi-Key; ComponentLink4URL: https://datasheet.ciiva.com/12667/pyu-rc0402-51-rohs-l-6-r-12667930.pdf?src-supplier=Mouser; ComponentLink4Description: https://datasheet.ciiva.com/12667/pyu-rc0402-51-rohs-l-6-r-12667930.pdf?src-supplier=Mouser; ComponentLink5URL: https://datasheet.ciiva.com/15189/getdatasheetpartid-323696-15189334.pdf?src-supplier=Verical; ComponentLink5Description: https://datasheet.ciiva.com/15189/getdatasheetpartid-323696-15189334.pdf?src-supplier=Verical; ComponentLink6URL: https://datasheet.ciiva.com/2453/pyu-r-int-thick-7-2453363.pdf?src-supplier=Digi-Key; ComponentLink6Description: https://datasheet.ciiva.com/2453/pyu-r-int-thick-7-2453363.pdf?src-supplier=Digi-Key; ComponentLink7URL: https://datasheet.ciiva.com/2453/pyu-r-int-thick-7-2453361.pdf?src-supplier=Digi-Key; ComponentLink7Description: https://datasheet.ciiva.com/2453/pyu-r-int-thick-7-2453361.pdf?src-supplier=Digi-Key; Supplier Part Number 1: 311-100KLRCT-ND
R230 = RES_1K_1%_100mW_0603: Chip Resistor Automotive Grade Thick Film 0603 1kOhm 1% Paper T/R; Manufacturer: Yageo; Voltage Rating: 50V; Temperature Coefficient: 100ppm/°C; Power Rating: 100mW; Manufacturer Part Number: AC0603FR-101KL; RoHS: Yes; Category: Chip SMD Resistors; Stock 1: 108593; Pricing 1: 1=0.10000, 10=0.02500, 100=0.01030, 1000=0.00463, 2500=0.00402, 5000=0.00332 (USD); Case Code (Imperial): 0603; Case Code (Metric): 1608; Min Operating Temperature: -55°C; Max Operating Temperature: 155°C; Packaging: Tape and Reel; Termination: SMD/SMT; Series: AC; Length: 1.6mm; Width: 0.8mm; Height: 0.45mm; RoHS Compliant: Yes; ComponentLink1URL: http://www.mouser.com/ds/2/447/yageodocoutput-1111992.pdf?src-supplier=Mouser; ComponentLink1Description: http://www.mouser.com/ds/2/447/yageodocoutput-1111992.pdf?src-supplier=Mouser; Supplier 1: Digi-Key; Supplier 2: Newark; Supplier 3: Mouser; Supplier Part Number 1: 13-AC0603FR-101KLDKR-ND; Supplier Part Number 2: 31AK9289; Supplier Part Number 3: 603-AC0603FR-101KL
R231 = RES_10R_5%_100mW_0603: SMD Chip Resistor, 10 Ohm, ± 5%, 100 mW, 0603 [1608 Metric], Thick Film, General Purpose; Manufacturer: Yageo; Temperature Coefficient: 200ppm/°C; Voltage Rating (DC): 50V; Power Rating: 100mW; Supplier 1: Digi-Key; Manufacturer Part Number: RC0603JR-0710RL; RoHS: Yes; Category: Chip SMD Resistors; Stock 1: 769777; Pricing 1: 1=0.1, 10=0.024, 50=0.0154, 100=0.013, 500=0.00894, 1000=0.00773 (USD); Number of Pins: 2; Case Code (Imperial): 0603; Case Code (Metric): 1608; Size Code: 0603; Min Operating Temperature: -55°C; Max Operating Temperature: 155°C; Resistor Type: Thick Film; Packaging: Tape and Reel; Voltage Rating: 50V; Termination: SMD/SMT; Features: Moisture Resistant; Series: RC; Max Power Dissipation: 100mW; Number of Terminations: 2; Construction: Rectangular; Resistance Tolerance: 5%; Length: 1.6mm; Width: 0.8mm; Depth: 0.8mm; Reach SVHC Compliant: No; Lead Free: Lead Free; Military Standard: Not; RoHS Compliant: Yes; ComponentLink1URL: https://datasheet.ciiva.com/46395/443971-46395069.pdf?src-supplier=Element14; ComponentLink1Description: https://datasheet.ciiva.com/46395/443971-46395069.pdf?src-supplier=Element14; ComponentLink2URL: https://datasheet.ciiva.com/7746/443971-7746431.pdf?src-supplier=Element14; ComponentLink2Description: https://datasheet.ciiva.com/7746/443971-7746431.pdf?src-supplier=Element14; Supplier Part Number 1: 311-10GRCT-ND
TP51 = TP_PAD_SMD_SMALL: Test Point, SMD pad, round, 1.5mm, 1.6mm, 3mm diameter
U25 = IC_IMU_9AXIS_ICM-20948: IMU (Inertial Measurement Unit), 9-Axis, Accelerometer, Gyroscope, Compass; Manufacturer: TDK; Sensor Type: Accelerometer,Gyroscope,Magnetometer; Output Type: SPI,I2C; Max Supply Voltage: 3.6V; Min Supply Voltage: 1.71V; Supplier 1: Mouser; Manufacturer Part Number: ICM-20948; RoHS: Yes; Category: Inertial Measurement Units (IMUs); Stock 1: 38177; Pricing 1: 1=8.32, 10=6.38, 50=6.38, 100=5.45, 250=5.41, 500=5.13, 1000=4.8, 2500=4.76, 5000=4.61, 10000=4.61 (USD); Mount: Surface Mount; Case/Package: QFN; Min Operating Temperature: -40°C; Max Operating Temperature: 85°C; Series: -; Packaging: Cut Tape; Length: 3mm; Width: 3mm; Height: 1.05mm; ComponentLink1URL: http://www.farnell.com/datasheets/2632662.pdf?src-supplier=Farnell; ComponentLink1Description: http://www.farnell.com/datasheets/2632662.pdf?src-supplier=Farnell; ComponentLink2URL: https://www.invensense.com/wp-content/uploads/2016/06/App-Note-eMD-20x48-User-Guide.pdf?src-supplier=Digikey; ComponentLink2Description: https://www.invensense.com/wp-content/uploads/2016/06/App-Note-eMD-20x48-User-Guide.pdf?src-supplier=Digikey; ComponentLink3URL: http://www.farnell.com/datasheets/2632662.pdf?src-supplier=Element14; ComponentLink3Description: http://www.farnell.com/datasheets/2632662.pdf?src-supplier=Element14; ComponentLink4URL: http://www.farnell.com/datasheets/2632662.pdf?src-supplier=Newark; ComponentLink4Description: http://www.farnell.com/datasheets/2632662.pdf?src-supplier=Newark; ComponentLink5URL: https://www.invensense.com/wp-content/uploads/2016/06/App-Note-eMD-20x48-User-Guide.pdf?src-supplier=Avnet; ComponentLink5Description: https://www.invensense.com/wp-content/uploads/2016/06/App-Note-eMD-20x48-User-Guide.pdf?src-supplier=Avnet; ComponentLink6URL: https://www.invensense.com/wp-content/uploads/2016/06/App-Note-eMD-20x48-User-Guide.pdf?src-supplier=Component+Distributors+Inc.; ComponentLink6Description: https://www.invensense.com/wp-content/uploads/2016/06/App-Note-eMD-20x48-User-Guide.pdf?src-supplier=Component+Distributors+Inc.; Supplier Part Number 1: 410-ICM-20948
U26 = IC_REG_LDO_1.8V_250mA_LP5907UVX-1.8/NOPB: Low Dropout Regulators(LDO) Positive Fixed 200mV @ 250mA 5.5V 1.8V 250mA DSBGA-4 RoHS; Manufacturer: Texas Instruments; Number of Outputs: 1; Min Input Voltage: 2.2V; Quiescent Current: 25uA; Accuracy: 2%; Dropout Voltage: 50mV; Max Supply Current: 425uA; Power Supply Rejection Ratio (PSRR): 60dB; Supplier 1: Digikey; Manufacturer Part Number: LP5907UVX-1.8/NOPB; RoHS: Yes; Category: Voltage Regulators - Linear; Stock 1: 47909; Pricing 1: 1=0.66, 10=0.564, 25=0.5268, 100=0.4214, 250=0.39128, 500=0.33108, 1000=0.25583 (USD); Mount: Surface Mount; Case/Package: SMD/SMT; Min Operating Temperature: -40°C; Max Operating Temperature: 125°C; Package Quantity: 3000; Packaging: Tape and Reel; Max Input Voltage: 5.5V; Max Output Current: 250mA; Output Voltage: 1.8V; Polarity: Positive; Output Type: Fixed; Series: -; Output Configuration: Positive; Number of Regulators: 1; Min Output Voltage: 1.8V; Output Current: 250mA; Radiation Hardening: No; Lead Free: Lead Free; RoHS Compliant: Yes; ComponentLink1URL: https://datasheet.ciiva.com/6597/lp5907-6597398.pdf?src-supplier=Digikey; ComponentLink1Description: https://datasheet.ciiva.com/6597/lp5907-6597398.pdf?src-supplier=Digikey; ComponentLink2URL: https://datasheet.ciiva.com/14278/lp5907-14278557.pdf?src-supplier=Avnet; ComponentLink2Description: https://datasheet.ciiva.com/14278/lp5907-14278557.pdf?src-supplier=Avnet; Supplier Part Number 1: 296-35634-1-ND
U27 = IC_LEVEL_TRASLATOR_NTS0104GU12,115: NTS0104 Series 50 Mbps Dual Supply 3-ST O-DRN Translating Transceiver- XQFN-12; Manufacturer: NXP Semiconductors; Logic Function: Translator; Low Level Output Current: 1mA; High Level Output Current: -20uA; Quiescent Current: 45uA; Data Rate: 50Mbps; Number of Channels: 4; Propagation Delay: 4.4ns; Max Supply Voltage: 5.5V; Min Supply Voltage: 1.65V; Max Power Dissipation: 250mW; Turn-On Delay Time: 5.8ns; Output Type: Voltage; Supplier 1: Digikey; Manufacturer Part Number: NTS0104GU12,115; RoHS: Yes; Category: Voltage Level Shifters; Stock 1: 126626; Pricing 1: 1=1.16, 10=1.034, 25=0.982, 100=0.8065, 250=0.75396, 500=0.66628, 1000=0.52601 (USD); Mount: Surface Mount; Number of Pins: 12; Min Operating Temperature: -40°C; Max Operating Temperature: 125°C; Packaging: Tape and Reel; Package Quantity: 1; Number of Bits: 4; Series: -; Lead Free: Lead Free; RoHS Compliant: Yes; ComponentLink1URL: https://datasheet.ciiva.com/1899/nts0104-1899088.pdf?src-supplier=Digikey; ComponentLink1Description: https://datasheet.ciiva.com/1899/nts0104-1899088.pdf?src-supplier=Digikey; ComponentLink2URL: https://datasheet.ciiva.com/4834/nts0104-92130-4834865.pdf?src-supplier=Mouser; ComponentLink2Description: https://datasheet.ciiva.com/4834/nts0104-92130-4834865.pdf?src-supplier=Mouser; ComponentLink3URL: https://datasheet.ciiva.com/1899/nts0104-1899089.pdf?src-supplier=Digikey; ComponentLink3Description: https://datasheet.ciiva.com/1899/nts0104-1899089.pdf?src-supplier=Digikey; ComponentLink4URL: https://datasheet.ciiva.com/1899/nts0104-1899090.pdf?src-supplier=Digikey; ComponentLink4Description: https://datasheet.ciiva.com/1899/nts0104-1899090.pdf?src-supplier=Digikey; ComponentLink5URL: https://datasheet.ciiva.com/8244/nts0104-8244168.pdf?src-supplier=Avnet; ComponentLink5Description: https://datasheet.ciiva.com/8244/nts0104-8244168.pdf?src-supplier=Avnet; Supplier Part Number 1: 568-8408-1-ND
U28 = IC_MODULE_UBLOX_NEO-M9N-00B: GNSS module, Flash, TCXO, SAW, LNA, LCC, 12x16 mm Professional Grade; Manufacturer: u-blox; Supplier 1: Mouser; Manufacturer Part Number: NEO-M9N-00B; RoHS: Yes; Category: RF Receivers, Transceivers; Stock 1: 8287; Pricing 1: 1=27, 10=23.92, 50=19.61, 100=15.68, 250=15.68, 1000=15.68, 10000=15.68 (USD); RoHS Compliant: Yes; ComponentLink1URL: https://datasheet.octopart.com/NEO-M9N-00B-u-blox-datasheet-166813760.pdf?src-supplier=Future+Electronics; ComponentLink1Description: https://datasheet.octopart.com/NEO-M9N-00B-u-blox-datasheet-166813760.pdf?src-supplier=Future+Electronics; ComponentLink2URL: https://datasheet.octopart.com/NEO-M9N-00B-u-blox-datasheet-166811447.pdf?src-supplier=TME; ComponentLink2Description: https://datasheet.octopart.com/NEO-M9N-00B-u-blox-datasheet-166811447.pdf?src-supplier=TME; Supplier Part Number 1: 377-NEO-M9N-00B
U29 = IC_REG_LDO_3.3V_1A_AP2114H-3.3TRG1: IC REG LDO 3.3V 1A SOT223; Manufacturer: Diodes; Supplier 1: Digikey; Manufacturer Part Number: AP2114H-3.3TRG1; RoHS: Yes; Category: Voltage Regulators - Linear; Stock 1: 34610; Pricing 1: 1=0.41, 10=0.332, 25=0.304, 100=0.2262, 250=0.20504, 500=0.16968, 1000=0.12726 (USD); ComponentLink1URL: https://datasheet.ciiva.com/29569/ap2114-29569881.pdf?src-supplier=Digikey; ComponentLink1Description: https://datasheet.ciiva.com/29569/ap2114-29569881.pdf?src-supplier=Digikey; ComponentLink2URL: https://datasheet.ciiva.com/29569/ap2114-29569882.pdf?src-supplier=Digikey; ComponentLink2Description: https://datasheet.ciiva.com/29569/ap2114-29569882.pdf?src-supplier=Digikey; ComponentLink3URL: https://datasheet.ciiva.com/29569/ap2114-29569883.pdf?src-supplier=Digikey; ComponentLink3Description: https://datasheet.ciiva.com/29569/ap2114-29569883.pdf?src-supplier=Digikey; Supplier Part Number 1: AP2114H-3.3TRG1DICT-ND